# Altium schematic sheet Sheet2.SchDoc
size A4
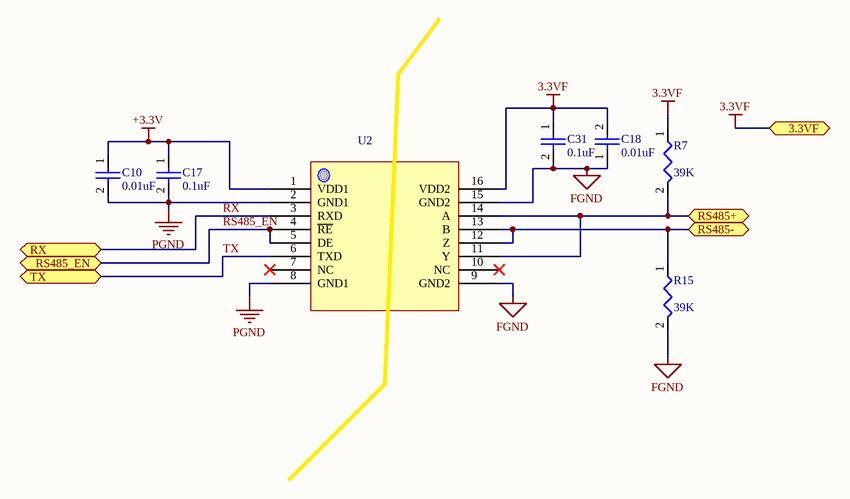
[diagram p0: Sheet2.SchDoc]

## Parts
C10  value 0.01uF  [C0805]  (hidden comment: CAP)
C17  value 0.1uF  [C0805]  (hidden comment: CAP)
C18  value 0.01uF  [C0805]  (hidden comment: CAP)
C31  value 0.1uF  [C0805]  (hidden comment: CAP)
R7  value 39K  [R0805]  (hidden comment: RES)
R15  value 39K  [R0805]  (hidden comment: RES)
U2  ADM2484E  [SOIC16]  (value not drawn)

## Ports
3.3VF, RS485+, RS485-, RS485_EN, RX, TX

## Nets
3.3VF: C18.2 C31.1 R7.1 U2.16(VDD2) ; port 3.3VF
+3.3V: C10.1 C17.1 U2.1(VDD1)
FGND: C18.1 C31.2 R15.2 U2.9(GND2) U2.15(GND2)
PGND: C10.2 C17.2 U2.2(GND1) U2.8(GND1)
RS485+: R7.2 U2.11(Y) U2.14(A) ; port RS485+
RS485-: R15.1 U2.12(Z) U2.13(B) ; port RS485-
RS485_EN: U2.4(~{RE}) U2.5(DE) ; port RS485_EN
RX: U2.3(RXD) ; port RX
TX: U2.6(TXD) ; port TX

Not connected (* = marked no-connect by the designer): U2 7(NC)* 10(NC)*

## Library data of the parts
C10 C18 = EC00037: CAP SMD X7R 50V 10% 10nF 0805 ROHS; Manufacturer: YAGEO; Manufacturer P/N: CC0805KRX7R9BB103; ID: 37; HelpURL: *; P/N: EC00037
C17 C31 = EC00014: CAP SMD CR X7R 50V 10% 0.1uF 0805 ROHS; Manufacturer: YAGEO; Manufacturer P/N: CC0805KRX7R9BB104; ID: 14; HelpURL: *; P/N: EC00014
R7 R15 = ER00021: RES THICK_FILM SMD 39K 5% 1/8W ROHS 0805; Manufacturer: YAGEO; Manufacturer P/N: RC0805JR-0739KL; ID: 21; HelpURL: *; P/N: ER00021
U2 = EU00059: IC Isolated, RS-485/RS-422 transceiver,5kV,SOIC16_W,ROHS; Manufacturer: Analog Devices; Manufacturer P/N: ADM2484EBRWZ-REEL7; Pin Number: 16; ID: 59; Value: ADM2484EBRWZ-REEL7; HelpURL: \\192.168.1.3\Esh\Department\RD\CAD\Component\RS485\ADM2484E.pdf; P/N: EU00059; Type: *****